# EAGLE board E-Reader (EAGLE 9.7.0)
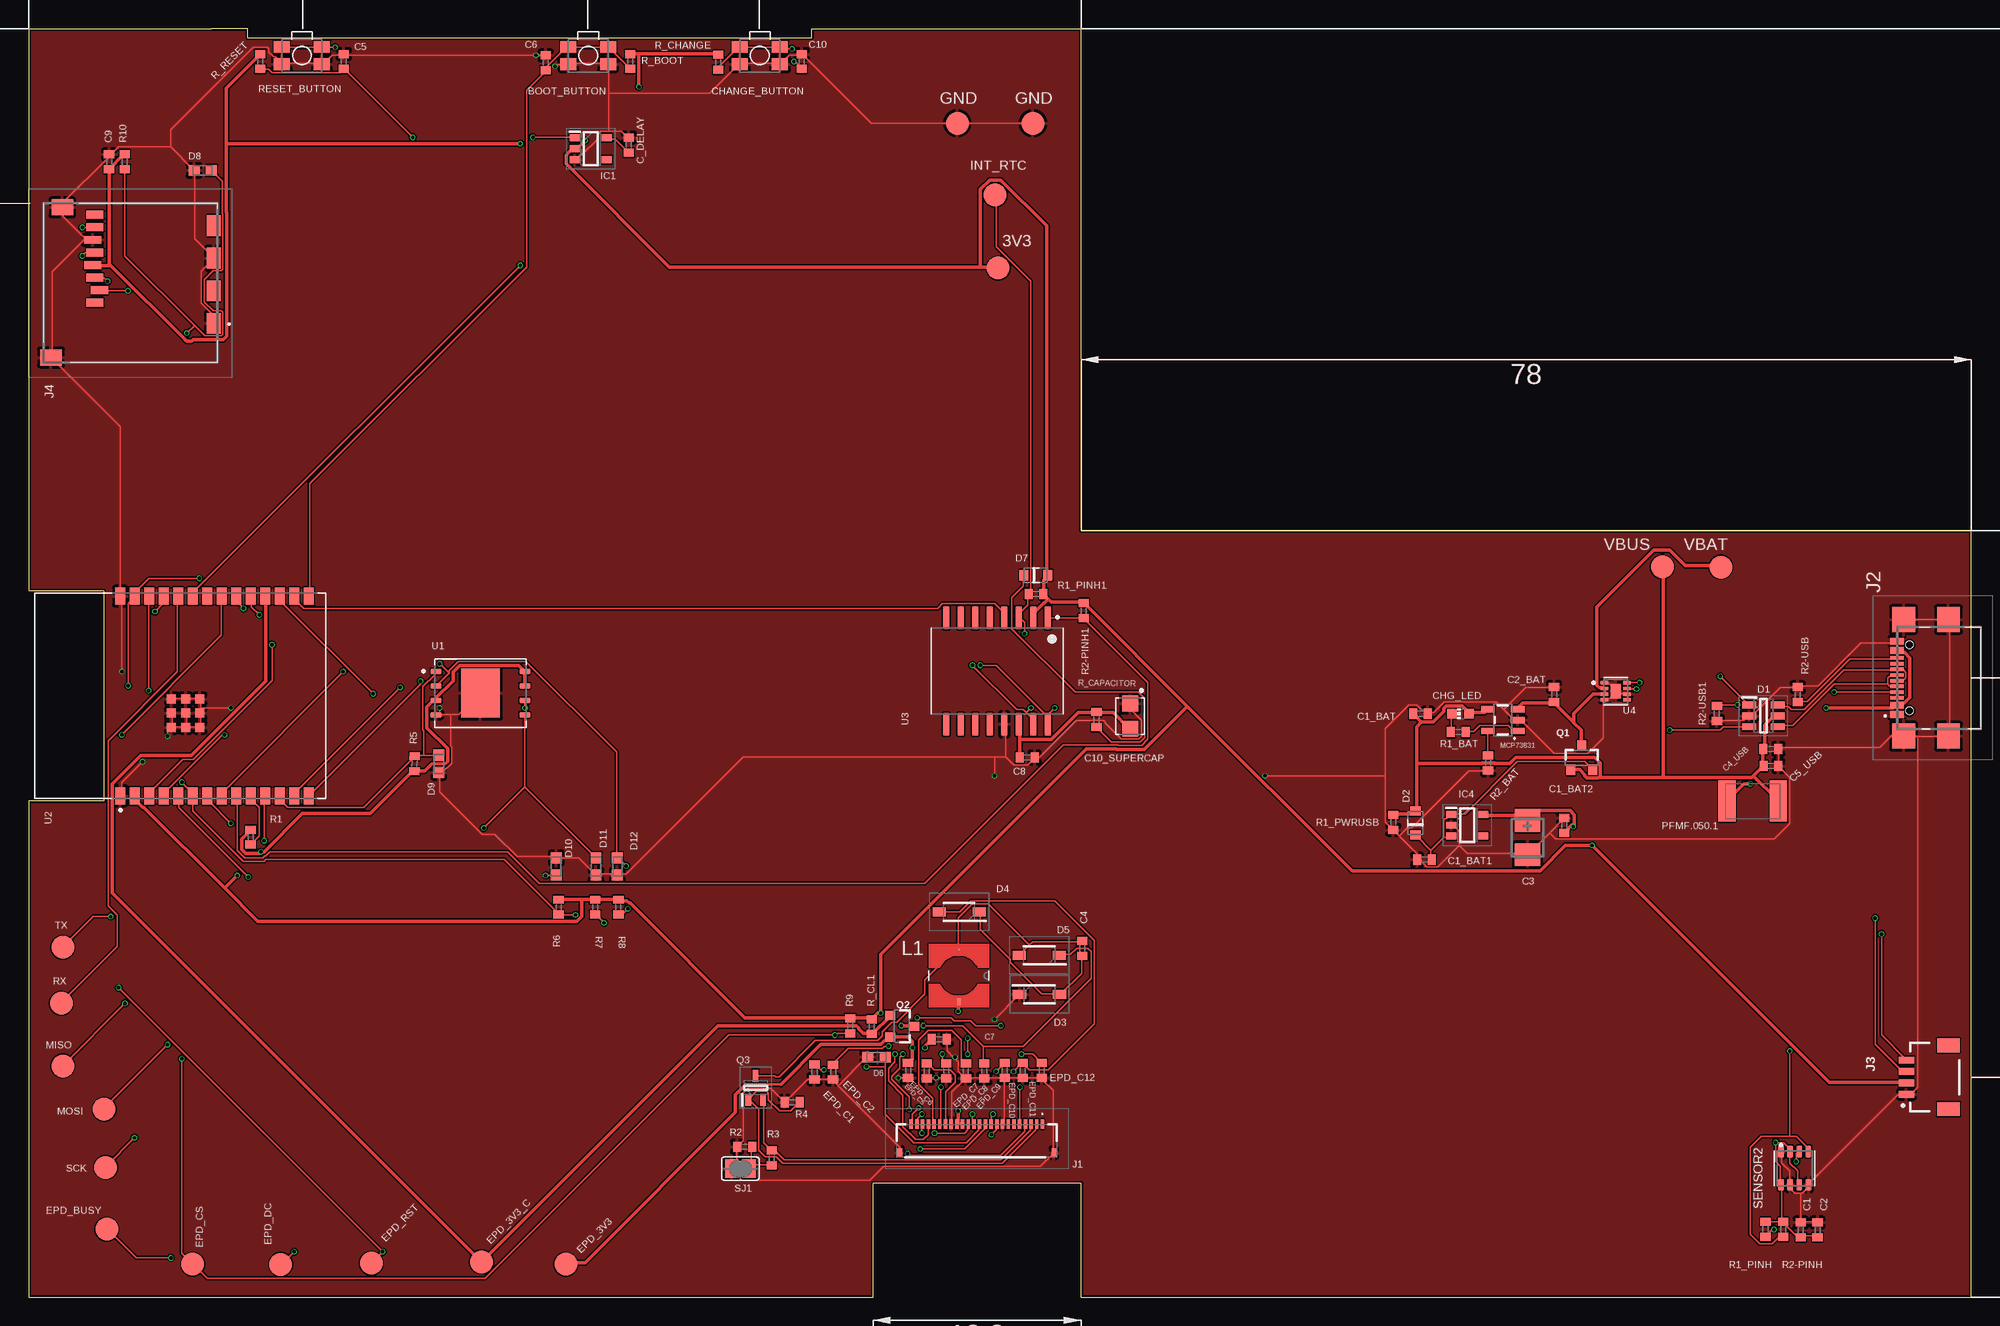
[diagram p1: board, top side]
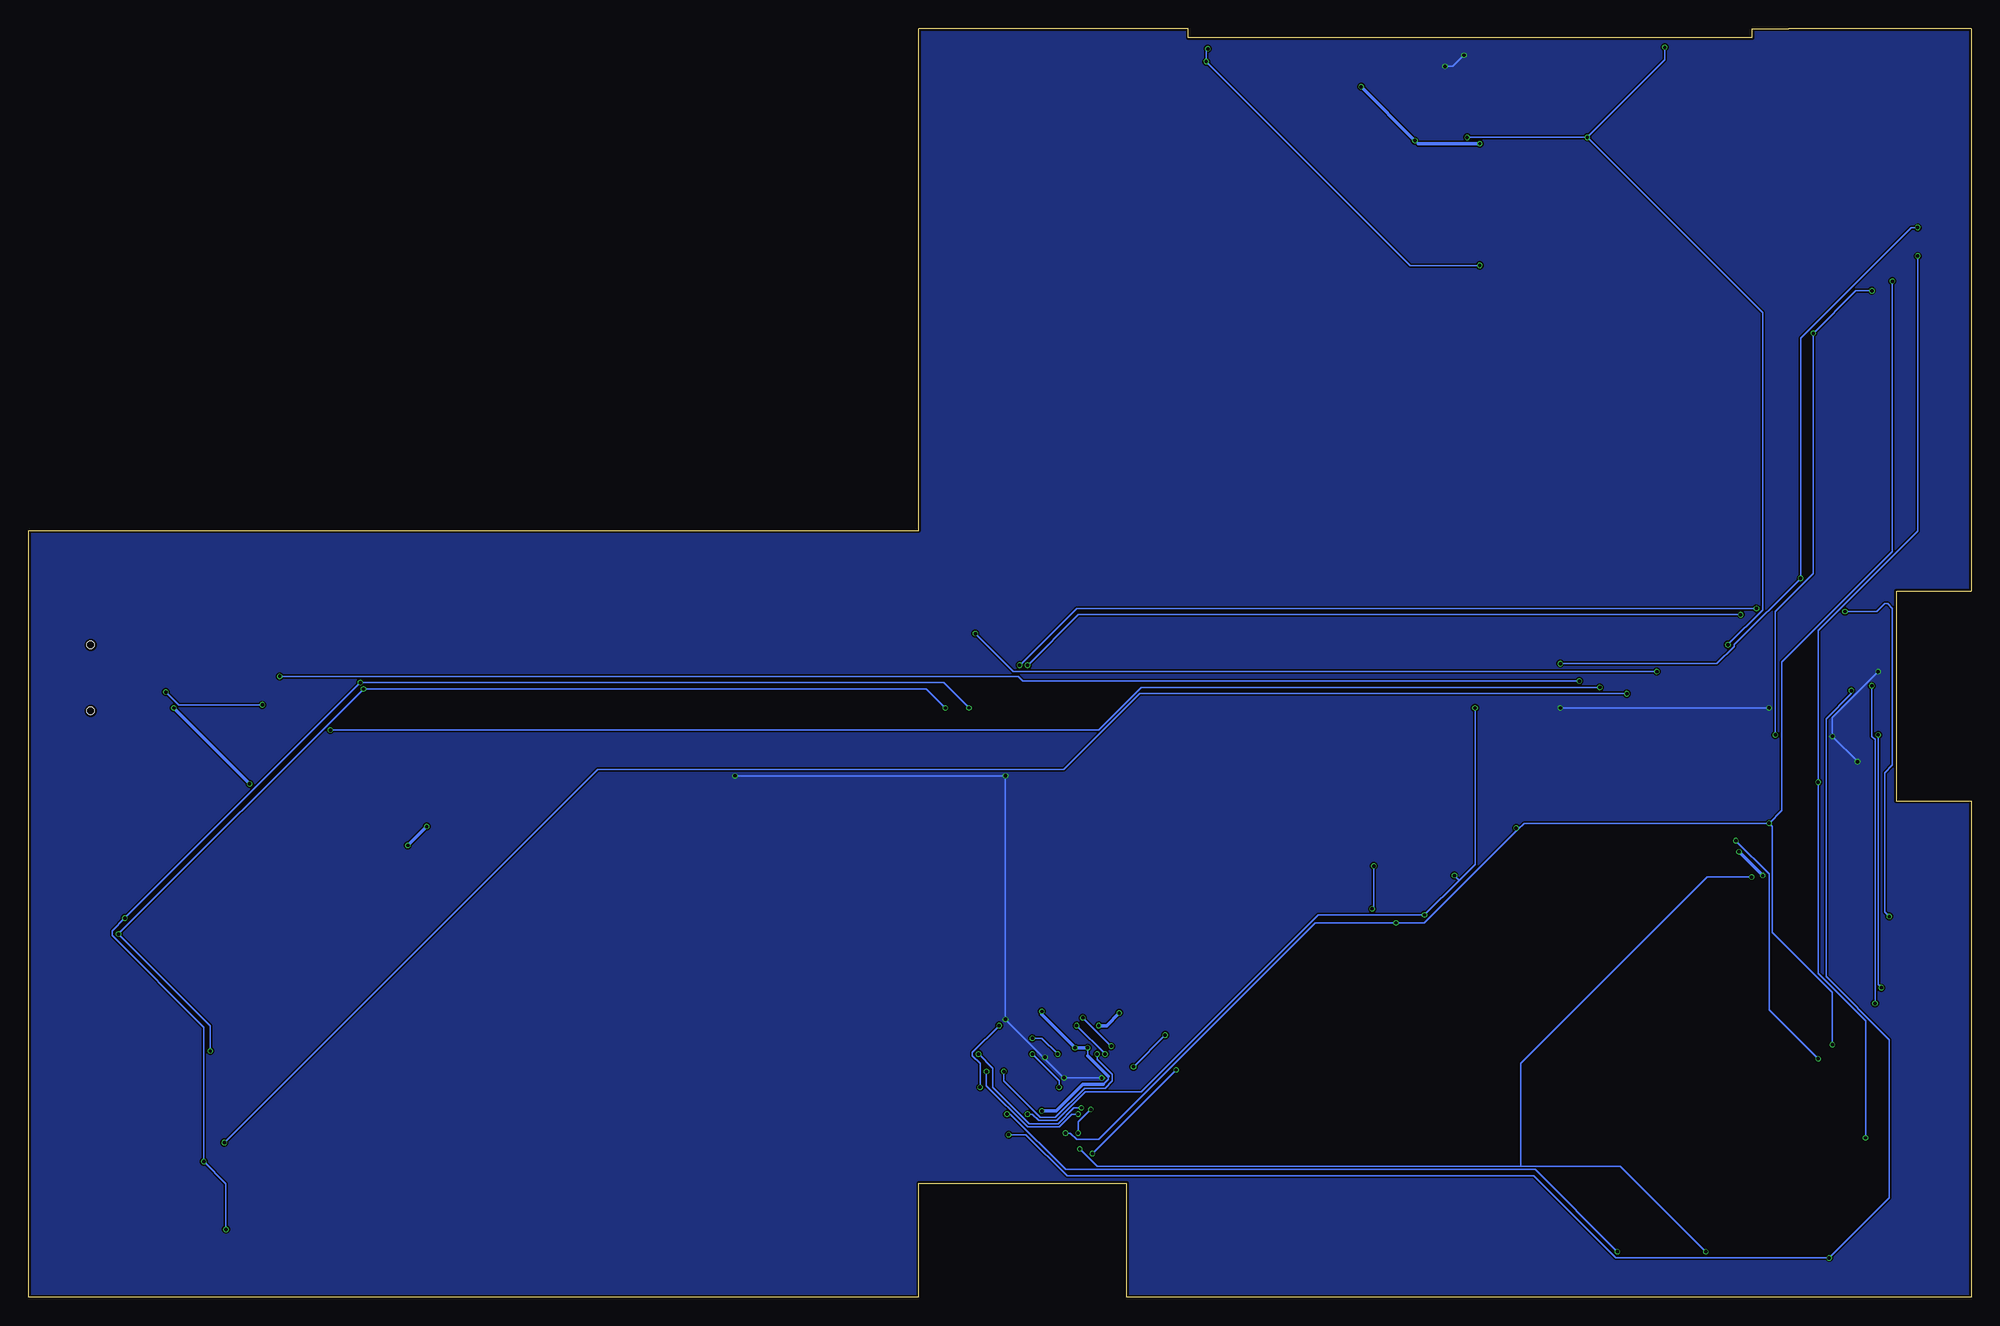
[diagram p2: board, bottom side, seen from below]

Size 170.2 x 111.2 mm. Coordinates in mm from the lower left corner, seen from the top.
Outline: 0,0 74,0 74,10 92.2,10 92.2,0 170.2,0 170.2,67.2 92.2,67.2 92.2,111.2 71.9,111.2 68.6,111.2 68.6,110.4 19.2,110.4 19.2,111.2 16,111.2 0,111.2 0,67.2 0,61.9 6.6,61.9 6.6,43.5 0,43.5 0,0
Copper layers (1*16): Top 0.035mm / dielectric 1.6mm / Bottom 0.035mm
Design rules "jlcpcb-2layers *": minimum track width 0.1mm, minimum drill 0.3mm, track to track 5mil, track to pad 5mil, pad to pad 5mil, via to via 5mil, smd to smd 5mil, copper to edge 0.2mm, drill to drill 6mil, minimum pad ring 10mil, minimum via ring 3mil, stop-mask expansion 4mil, vias tented up to drill 0mil, thermal gap 10mil

## Footprints (pad centres in the part's own frame; a part is rotated, then mirrored left to right if it is on the bottom)
MYBUTTON = smd 1.4 x 1.05: 1 1.75,0.75; 2 -1.75,0.75; 3 -1.75,-0.75; 4 1.75,-0.75
EAGLE-LTSPICE_C0402 = smd 0.7 x 0.9: 1 -0.65,0; 2 0.65,0
RCL_CT3528 = smd 2 x 2.2: + -1.5,0; - 1.5,0
CAPCP3225X100N = smd 1.4 x 1.4: 1 -1.1,0; 2 1.1,0
ADAFRUIT_CHIP-LED0603 = smd 0.8 x 0.8: A 0,-0.75; C 0,0.75
SOT95P280X145-6N = smd 1.2 x 0.6: 1 -1.25,0.95; 2 -1.25,0; 3 -1.25,-0.95; 4 1.25,-0.95; 5 1.25,0; 6 1.25,0.95
ESP32_WROVER_AVX---SD0805S020S1R0_AVX_SD0805S020S1R0_0 = smd 0.8 x 0.9: 1 -1.05,0; 2 1.05,0
SOD3716X135N = smd 1.15 x 0.8: 1 -1.75,0; 2 1.75,0
DIOC1608X36N = smd 0.97 x 0.94: 1 -0.75,0; 2 0.75,0
SOT95P280X125-5N = smd 0.9 x 0.6: 1 -1.4,0.95; 2 -1.4,0; 3 -1.4,-0.95; 4 1.4,-0.95; 5 1.4,0.95
SOT95P280X120-5N = smd 0.9 x 0.6: 1 -1.4,0.95; 2 -1.4,0; 3 -1.4,-0.95; 4 1.4,-0.95; 5 1.4,0.95
FH34SRJ24S05SH99 = smd 0.3 x 0.8: 1 5.75,1.45; 2 5.25,1.45; 3 4.75,1.45; 4 4.25,1.45; 5 3.75,1.45; 6 3.25,1.45; 7 2.75,1.45; 8 2.25,1.45; 9 1.75,1.45; 10 1.25,1.45; 11 0.75,1.45; 12 0.25,1.45; 13 -0.25,1.45; 14 -0.75,1.45; 15 -1.25,1.45; 16 -1.75,1.45; 17 -2.25,1.45; 18 -2.75,1.45; 19 -3.25,1.45; 20 -3.75,1.45; 21 -4.25,1.45; 22 -4.75,1.45; 23 -5.25,1.45; 24 -5.75,1.45 | smd 0.4 x 0.8: MP1 6.75,-1.05; MP2 -6.75,-1.05
SAMACSYS_PARTS_USB4110GFA = smd 0.3 x 1.15: A1 -3.35,3.678; A4 -2.55,3.678; A5 -1.25,3.678; A6 -0.25,3.678; A7 0.25,3.678; A8 1.25,3.678; A9 2.55,3.678; A12 3.35,3.678; B1 3.05,3.678; B4 2.25,3.678; B5 1.75,3.678; B6 0.75,3.678; B7 -0.75,3.678; B8 -1.75,3.678; B9 -2.25,3.678; B12 -3.05,3.678 | smd 2.18 x 2: MP1 -5.11,-0.827; MP2 5.11,-0.827; MP3 -5.11,3.103; MP4 5.11,3.103 | hole 0.65: -2.89,2.603; 2.89,2.603
JST04_1MM_RA = smd 0.6 x 1.35: 1 -1.5,0; 2 -0.5,0; 3 0.5,0; 4 1.5,0 | smd 1.2 x 2: NC1 2.8,-3.675; NC2 -2.8,-3.675
112ATAARR03ATTEND = smd 1.8 x 1.2: G1 10.6,10.4; G2 4.9,10.4; S1 7.75,10.4; S2 2.05,10.4 | smd 1.4 x 1.9: G3 13.6,-3.85; G4 0.45,-2.85 | smd 0.7 x 1.5: P1 8.8,0; P2 7.7,0.4; P3 6.6,0; P4 5.5,-0.2; P5 4.4,0; P6 3.3,-0.2; P7 2.2,0; P8 1.1,0
IND_4828-WE-TPC_WRE = smd 0.127 x 0.127: 1 -2.286,0 | smd 0.61 x 0.305: 2 2.286,0
ESP32_WROVER_SPARKFUN-IC-POWER_SOT23-5 = smd 0.55 x 1.2: 1 -0.95,-1.3; 2 0,-1.3; 3 0.95,-1.3; 4 0.95,1.3; 5 -0.95,1.3
ESP32C6_VARISTOR_CT/CN1812 = smd 1.5 x 3.6: 1 -2.25,0; 2 2.25,0
ESP32_WROVER_SPARKFUN-DISCRETESEMI_SOT23-3 = smd 0.8 x 0.9: 1 -0.95,-1; 2 0.95,-1; 3 0,1.1
SOT65P210X110-3N = smd 1.05 x 0.5: 1 -1.05,0.65; 2 -1.05,-0.65; 3 1.05,0
ESP32_WROVER_EAGLE-LTSPICE_R0402 = smd 0.7 x 0.9: 1 -0.65,0; 2 0.65,0
ESP32_WROVER_BME680_PSON80P300X300X100-8N = smd 1.016 x 0.5: 1 1.458,1.2; 2 1.458,0.4; 3 1.458,-0.4; 4 1.458,-1.2; 5 -1.458,-1.22; 6 -1.458,-0.4; 7 -1.458,0.4; 8 -1.458,1.2
SJ = smd 1.168 x 1.6: 1 -0.762,0; 2 0.762,0
TP20R = smd 2 x 2: TP 0,0
SON127P600X800X80-9N = smd 0.94 x 0.44: 1 -3.895,1.905; 2 -3.895,0.635; 3 -3.895,-0.635; 4 -3.895,-1.905; 5 3.895,-1.905; 6 3.895,-0.635; 7 3.895,0.635; 8 3.895,1.905 | smd 3.4 x 4.3: 9 0,0
XCVR_ESP32-C6-WROOM-1-N8 = smd 1.5 x 0.9: 1 -8.75,5.26; 2 -8.75,3.99; 3 -8.75,2.72; 4 -8.75,1.45; 5 -8.75,0.18; 6 -8.75,-1.09; 7 -8.75,-2.36; 8 -8.75,-3.63; 9 -8.75,-4.9; 10 -8.75,-6.17; 11 -8.75,-7.44; 12 -8.75,-8.71; 13 -8.75,-9.98; 14 -8.75,-11.25; 15 8.75,-11.25; 16 8.75,-9.98; 17 8.75,-8.71; 18 8.75,-7.44; 19 8.75,-6.17; 20 8.75,-4.9; 21 8.75,-3.63; 22 8.75,-2.36; 23 8.75,-1.09; 24 8.75,0.18; 25 8.75,1.45; 26 8.75,2.72; 27 8.75,3.99; 28 8.75,5.26 | smd 0.8 x 0.8: 29_1 -2.755,0.79; 29_2 -1.505,0.79; 29_3 -0.255,0.79; 29_4 -2.755,-0.46; 29_5 -1.505,-0.46; 29_6 -0.255,-0.46; 29_7 -2.755,-1.71; 29_8 -1.505,-1.71; 29_9 -0.255,-1.71
SOIC127P1032X265-16N = smd 2.05 x 0.59: 1 -4.655,4.445; 2 -4.655,3.175; 3 -4.655,1.905; 4 -4.655,0.635; 5 -4.655,-0.635; 6 -4.655,-1.905; 7 -4.655,-3.175; 8 -4.655,-4.445; 9 4.655,-4.445; 10 4.655,-3.175; 11 4.655,-1.905; 12 4.655,-0.635; 13 4.655,0.635; 14 4.655,1.905; 15 4.655,3.175; 16 4.655,4.445
SON50P200X200X80-9N = smd 0.76 x 0.27: 1 -0.985,0.75; 2 -0.985,0.25; 3 -0.985,-0.25; 4 -0.985,-0.75; 5 0.985,-0.75; 6 0.985,-0.25; 7 0.985,0.25; 8 0.985,0.75 | smd 0.9 x 1.3: 9 0,0

## Placement (x,y rotation side)
BOOT_BUTTON  BUTTON_CUSYOMV1  [MYBUTTON]  49.03,108.83 180 top
C1  100nF  [EAGLE-LTSPICE_C0402]  155.24,5.93 90 top
C1_BAT  4.7uF  [EAGLE-LTSPICE_C0402]  121.93,51.15 0 top
C1_BAT1  4.7uF  [EAGLE-LTSPICE_C0402]  122.28,38.37 180 top
C1_BAT2  4.7uF  [EAGLE-LTSPICE_C0402]  134.52,41.37 90 top
C2  100nF  [EAGLE-LTSPICE_C0402]  156.72,5.93 90 top
C2_BAT  4.7uF  [EAGLE-LTSPICE_C0402]  133.64,52.85 90 top
C3  100uF TANT  [RCL_CT3528]  131.31,40.3 270 top
C4  4.7uF/25V  [EAGLE-LTSPICE_C0402]  92.31,30.59 90 top
C4_USB  100nF  [EAGLE-LTSPICE_C0402]  152.63,48.07 0 top
C5  1uF  [EAGLE-LTSPICE_C0402]  27.61,108.31 90 top
C5_USB  4.7uF  [EAGLE-LTSPICE_C0402]  152.64,46.57 0 top
C6  100nF  [EAGLE-LTSPICE_C0402]  45.3,108.21 90 top
C7  10uF  [EAGLE-LTSPICE_C0402]  79.79,22.63 0 top
C8  100nF  [EAGLE-LTSPICE_C0402]  87.48,47.33 0 top
C9  100nF  [EAGLE-LTSPICE_C0402]  7.06,99.53 90 top
C10  100nF  [EAGLE-LTSPICE_C0402]  67.74,108.31 90 top
C10_SUPERCAP  CPH3225A  [CAPCP3225X100N]  96.49,50.94 270 top
C_DELAY  100nF  [EAGLE-LTSPICE_C0402]  52.57,100.99 90 top
CHANGE_BUTTON  BUTTON_CUSYOMV1  [MYBUTTON]  64.06,108.83 180 top
CHG_LED  [ADAFRUIT_CHIP-LED0603]  125.44,51.15 90 top
D1  USBLC6-2SC6Y  [SOT95P280X145-6N]  151.98,50.97 0 top
D2  ESP32_WROVER_AVX---SD0805S020S1R0_AVX_SD0805S020S1R0_0_0AVX_SD0805S020S1R0_0_0  [ESP32_WROVER_AVX---SD0805S020S1R0_AVX_SD0805S020S1R0_0]  121.49,41.58 90 top
D3  MBR0530  [SOD3716X135N]  88.56,26.57 0 top
D4  MBR0530  [SOD3716X135N]  81.52,33.78 180 top
D5  MBR0530  [SOD3716X135N]  88.54,29.98 180 top
D6  PGB1010603MR  [DIOC1608X36N]  74.28,21.07 0 top
D7  ESP32_WROVER_AVX---SD0805S020S1R0_AVX_SD0805S020S1R0_0_0AVX_SD0805S020S1R0_0_0  [ESP32_WROVER_AVX---SD0805S020S1R0_AVX_SD0805S020S1R0_0]  88.24,63.28 0 top
D8  PGB1010603MR  [DIOC1608X36N]  15.26,98.77 0 top
D9  PGB1010603MR  [DIOC1608X36N]  35.94,46.77 90 top
D10  PGB1010603MR  [DIOC1608X36N]  46.22,37.77 270 top
D11  PGB1010603MR  [DIOC1608X36N]  49.7,37.77 90 top
D12  PGB1010603MR  [DIOC1608X36N]  51.58,37.77 90 top
EPD_C1  1uF/50V  [EAGLE-LTSPICE_C0402]  68.85,19.77 90 top
EPD_C2  1uF/50V  [EAGLE-LTSPICE_C0402]  70.48,19.75 90 top
EPD_C5  0.1uF/50V  [EAGLE-LTSPICE_C0402]  77.05,19.89 90 top
EPD_C6  1uF/50V  [EAGLE-LTSPICE_C0402]  78.69,19.85 90 top
EPD_C7  1uF/50V  [EAGLE-LTSPICE_C0402]  80.4,19.85 90 top
EPD_C8  1uF/50V  [EAGLE-LTSPICE_C0402]  82.11,19.85 90 top
EPD_C9  1uF/50V  [EAGLE-LTSPICE_C0402]  83.72,19.85 90 top
EPD_C10  1uF/50V  [EAGLE-LTSPICE_C0402]  85.51,19.89 90 top
EPD_C11  1uF/50V  [EAGLE-LTSPICE_C0402]  87.09,19.89 90 top
EPD_C12  1uF/50V  [EAGLE-LTSPICE_C0402]  88.75,19.89 90 top
IC1  BD5229G-TR  [SOT95P280X125-5N]  49.25,100.67 0 top
IC4  XC6220A331MR-G  [SOT95P280X120-5N]  126.03,41.39 0 top
J1  FH34SRJ-24S-0.5SH_99_  [FH34SRJ24S05SH99]  83.07,13.74 0 top
J2  SAMACSYS_PARTS_USB4110-GF-A  [SAMACSYS_PARTS_USB4110GFA]  167.36,54.3 90 top
J3  QWIIC_RIGHT_ANGLE  [JST04_1MM_RA]  164.51,19.3 90 top
J4  112A-TAAR-R03_ATTEND  [112ATAARR03ATTEND]  5.82,95.98 270 top
L1  68uH  [IND_4828-WE-TPC_WRE]  81.5,28.2 270 top
MCP73831  ESP32_WROVER_SPARKFUN-IC-POWER_MCP73831  [ESP32_WROVER_SPARKFUN-IC-POWER_SOT23-5]  129.15,50.59 90 top
PFMF.050.1  ESP32C6_VARISTORCN1812  [ESP32C6_VARISTOR_CT/CN1812]  151.04,43.5 0 top
Q1  20V/4.2A/52mΩ/1.4W  [ESP32_WROVER_SPARKFUN-DISCRETESEMI_SOT23-3]  136.06,47.26 0 top
Q2  20V/4.2A/52mΩ/1.4W  [ESP32_WROVER_SPARKFUN-DISCRETESEMI_SOT23-3]  76.48,23.76 270 top
Q3  SI1308EDL-T1-GE3  [SOT65P210X110-3N]  63.69,18.38 90 top
R1  10K  [ESP32_WROVER_EAGLE-LTSPICE_R0402]  19.45,40.33 90 top
R1_BAT  200  [ESP32_WROVER_EAGLE-LTSPICE_R0402]  125.25,49.55 0 top
R1_PINH  10K  [ESP32_WROVER_EAGLE-LTSPICE_R0402]  152.16,5.97 90 top
R1_PINH1  10K  [ESP32_WROVER_EAGLE-LTSPICE_R0402]  88.26,61.64 0 top
R1_PWRUSB  100K  [ESP32_WROVER_EAGLE-LTSPICE_R0402]  119.55,41.64 90 top
R2  2.2  [ESP32_WROVER_EAGLE-LTSPICE_R0402]  62.73,13.21 0 top
R2-PINH  10K  [ESP32_WROVER_EAGLE-LTSPICE_R0402]  153.72,5.97 90 top
R2-PINH1  10K  [ESP32_WROVER_EAGLE-LTSPICE_R0402]  92.43,60.19 90 top
R2-USB  5K1  [ESP32_WROVER_EAGLE-LTSPICE_R0402]  154.98,52.83 90 top
R2-USB1  5K1  [ESP32_WROVER_EAGLE-LTSPICE_R0402]  147.9,51.17 90 top
R2_BAT  2K  [ESP32_WROVER_EAGLE-LTSPICE_R0402]  127.86,46.85 90 top
R3  0.47  [ESP32_WROVER_EAGLE-LTSPICE_R0402]  65.11,12.23 90 top
R4  10K  [ESP32_WROVER_EAGLE-LTSPICE_R0402]  66.89,17.11 0 top
R5  10K  [ESP32_WROVER_EAGLE-LTSPICE_R0402]  33.81,46.78 268.5 top
R6  10K  [ESP32_WROVER_EAGLE-LTSPICE_R0402]  46.43,34.21 90 top
R7  10K  [ESP32_WROVER_EAGLE-LTSPICE_R0402]  49.65,34.21 90 top
R8  10K  [ESP32_WROVER_EAGLE-LTSPICE_R0402]  51.67,34.21 90 top
R9  10K  [ESP32_WROVER_EAGLE-LTSPICE_R0402]  71.99,23.81 90 top
R10  10K  [ESP32_WROVER_EAGLE-LTSPICE_R0402]  8.43,99.53 90 top
R_BOOT  10K  [ESP32_WROVER_EAGLE-LTSPICE_R0402]  52.71,108.31 90 top
R_CAPACITOR  15  [ESP32_WROVER_EAGLE-LTSPICE_R0402]  93.55,50.64 90 top
R_CHANGE  10K  [ESP32_WROVER_EAGLE-LTSPICE_R0402]  60.42,108.24 90 top
R_CL1  10K  [ESP32_WROVER_EAGLE-LTSPICE_R0402]  73.86,23.73 90 top
R_RESET  10K  [ESP32_WROVER_EAGLE-LTSPICE_R0402]  20.29,108.31 90 top
RESET_BUTTON  BUTTON_CUSYOMV1  [MYBUTTON]  23.95,108.83 180 top
SENSOR2  BME688  [ESP32_WROVER_BME680_PSON80P300X300X100-8N]  154.71,11.32 90 top
SJ1  [SJ]  62.36,11.29 0 top
TP1  TPTP20R  [TP20R]  3.01,30.69 0 top
TP2  TPTP20R  [TP20R]  2.88,25.79 0 top
TP3  TPTP20R  [TP20R]  148.25,63.99 0 top
TP4  TPTP20R  [TP20R]  81.37,102.89 0 top
TP5  TPTP20R  [TP20R]  87.99,102.89 0 top
TP6  TPTP20R  [TP20R]  3.01,20.29 0 top
TP7  TPTP20R  [TP20R]  6.63,16.49 0 top
TP8  TPTP20R  [TP20R]  6.75,11.39 0 top
TP9  TPTP20R  [TP20R]  6.87,5.99 0 top
TP10  TPTP20R  [TP20R]  14.38,2.91 0 top
TP11  TPTP20R  [TP20R]  22.09,2.89 0 top
TP12  TPTP20R  [TP20R]  30.03,3.01 0 top
TP13  TPTP20R  [TP20R]  39.68,3.11 0 top
TP14  TPTP20R  [TP20R]  143.13,64.01 0 top
TP15  TPTP20R  [TP20R]  84.68,96.61 0 top
TP16  TPTP20R  [TP20R]  84.93,90.21 0 top
TP17  TPTP20R  [TP20R]  47.08,2.91 0 top
U1  W25Q512JVEIQ  [SON127P600X800X80-9N]  39.59,52.96 0 top
U2  ESP32-C6-WROOM-1-N8  [XCVR_ESP32-C6-WROOM-1-N8]  13.3,52.71 90 top
U3  DS3231SN#  [SOIC127P1032X265-16N]  84.85,54.9 270 top
U4  MAX17048G+T10  [SON50P200X200X80-9N]  139.04,53.12 0 top

## Tracks (layer width: path | path; a pad name or v marks a point on that pad's centre or on a via)
3V3  (via drill 0.3)
  Top 0.15: 72.02,24.52 R9.2 | 77.56,23.82 Q2.3 | 73.96,24.52 R_CL1.2 | 49.58,34.9 R7.2 | 51.66,34.9 R8.2 | 131.3,41.83 C3.+ 131.44,41.83 | C9.1 7.06,98.75 | 7.06,90.44 7.2,90.44 | 5.68,90.44 J4.P4 | 89.19,63.16 D7.2 89.19,63.29 | 92.38,60.94 R2-PINH1.2 | 52.77,109 R_BOOT.2 | 84.9,90.3 TP16.TP | IC1.2 47.92,100.55
  Top 0.254: 35.29,46.71 35.35,46.78 36.53,46.78 36.7,46.95
  Top 0.3: U1.7 43.49,54.85 U1.8 43.35,54.98 42.94,55.4 37.81,55.4 37.79,55.4 37.19,54.8 37.19,54.04 35.62,52.48 | R1.2 19.39,40.86 18.7,40.16 18.7,39.24 19.04,38.9 19.2,38.9 20.2,38.9 v20.36,39.06 20.64,39.06 23.98,42.4 24.7,42.4 29.93,42.4 30.19,42.66 33.02,45.48 33.66,46.12 R5.2 34.7,46.13 35.29,46.71 | 72.02,24.52 73.82,24.52 R_CL1.2 | v76.45,23.82 77.56,23.82 | 73.96,24.52 74.37,24.93 v74.65,24.93 74.65,30.05 92.66,48.06 95.3,48.06 95.33,48.03 97.75,48.03 101.52,51.8 | 49.58,34.9 48.48,34.9 | 48.48,34.9 46.54,34.9 R6.2 | 51.66,34.9 49.72,34.9 R7.2 | 17.17,35.87 20.08,32.96 20.11,32.93 48.03,32.93 48.48,33.38 48.48,34.9 | U2.2 9.42,43.9 9.42,43.63 9.42,43.53 10.02,42.93 10.11,42.93 17.17,35.87 | R9.2 71.88,24.52 62.74,24.52 53,34.25 53,34.26 52.71,34.56 52.61,34.56 52.4,34.76 51.8,34.76 R8.2 | 17.17,35.87 v18.28,36.98 | 131.3,41.83 130.88,42.24 127.56,42.24 IC4.5 | 131.44,41.83 132.27,42.66 135.04,42.66 135.07,42.66 135.25,42.48 135.25,42.45 135.4,42.3 135.4,41.36 v135.31,41.27 135.18,41.41 134.62,40.86 C1_BAT2.1 | J3.2 164.4,18.84 157.75,18.84 v136.98,39.61 134.62,39.61 132.41,37.4 132.38,37.37 115.95,37.37 101.52,51.8 | C9.1 8.31,100.14 R10.2 | 17.31,101.11 17.31,105.95 20.22,108.86 R_RESET.2 | 7.2,90.44 13.71,83.93 13.74,83.9 13.84,83.8 14.3,83.8 14.42,83.92 17.05,83.92 17.37,84.25 17.37,95.06 17.31,95.11 17.31,101.11 | 5.68,90.44 7.06,90.44 7.06,98.75 | 89.19,63.16 88.92,62.88 88.92,61.77 R1_PINH1.2 89.33,61.22 | 92.38,60.94 89.61,60.94 89.33,61.22 | U3.2 88.09,59.55 88.09,59.97 88.09,60.02 88.93,60.86 88.97,60.86 89.33,61.22 | 53.46,109 60.39,109 R_CHANGE.2
  Top 0.3: 53.46,109 52.77,109 | 84.9,90.3 83.38,90.3 | 83.38,90.3 56.23,90.3 56.13,90.3 47.09,99.34 47.09,100 47.09,100.1 47.34,100.36 | v53.46,106.09 53.46,109 | 89.19,63.29 89.19,93.9 85.18,97.92 84.21,97.92 84.18,97.92 83.38,97.11 83.38,90.3 | v43.07,101.11 17.31,101.11 | 101.52,51.8 92.52,60.8 R2-PINH1.2 | v48.75,101.38 48.58,101.21 48.58,101.2 48.24,100.86 | 47.92,100.55 48.09,100.71 | 48.09,100.71 48.24,100.86 | 47.34,100.36 47.7,100.71 48.09,100.71 | 47.34,100.36 47.85,100.86 48.24,100.86 | 35.62,52.48 34.9,51.75 34.9,51.6 34.9,51 34.9,49.91 36.7,48.1 36.7,46.95 | U1.3 35.62,52.4 35.62,52.48
  Bottom 0.15: v48.75,101.38 48.48,101.11
  Bottom 0.3: v76.45,23.82 75.76,23.82 v74.65,24.93 | v18.28,36.98 v20.36,39.06 | v135.31,41.27 v136.98,39.61 | v48.75,101.38 v53.46,106.09 | 48.48,101.11 v43.07,101.11
32KHZ
  Top 0.15: U3.1 89.33,59.55 92.38,59.55 R2-PINH1.1 92.52,59.42 98.06,53.88 98.06,48.94 97.5,48.38 95.48,48.38 95.45,48.41 90.65,48.41 78.53,36.29 44.74,36.29 41.97,39.06 21.13,39.06 20.78,38.7 20.7,38.7 20.5,38.5 18.94,38.5 18.28,39.16 18.28,43.9 U2.9
DN
  Top 0.15: 162.88,53.74 163.01,53.6 163.57,53.6 J2.B7 | 162.88,53.74 162.88,54.29 163.01,54.43 163.57,54.43 J2.A7 | 162.88,53.74 158.17,53.74 154.57,50.14 153.32,50.14 D1.4
DP
  Top 0.15: J2.A6 163.71,54.15 164.29,54.15 164.46,54.32 164.46,54.78 164.25,54.98 163.71,54.98 J2.B6 163.57,54.98 159,54.98 155.54,51.52 154.43,51.52 154.15,51.8 153.32,51.8 D1.6
EPD_3V3  (via drill 0.3)
  Top 0.15: 81.44,15.23 J1.16 | 75.48,22.85 Q2.2 | v78.53,21.88 78.53,22.02 | 79.08,22.58 C7.1 | 47.09,3.05 TP17.TP
  Top 0.2: 62.85,18.7 63.33,18.7 63.35,18.68 65.91,18.68 65.93,18.7
  Top 0.3: 81.44,15.23 81.72,15.23 J1.15 | 75.48,22.85 77.01,22.85 77.42,22.44 v77.42,21.88 77.42,20.91 77.14,20.64 EPD_C5.2 | 78.53,22.02 79.08,22.58 | v81.44,16.34 81.44,15.23 | 81.44,15.23 J1.16 | 47.09,3.05 48.75,3.05 61.91,16.2 61.91,17.73 61.91,17.76 62.85,18.7 | 65.93,18.7 69.39,22.16 74.65,22.16 75.34,22.85 Q2.2 | v81.44,25.07 81.44,25.4 L1.2
  Bottom 0.15: 76.04,18.7 75.62,19.11 75.62,19.39 | v77.42,21.88 77.42,21.19 | 81.44,24.79 v81.44,25.07
  Bottom 0.3: v77.42,21.88 v78.53,21.88 81.44,24.79 | v81.44,16.34 80.19,16.34 77.84,18.7 76.04,18.7 | 77.42,21.19 75.62,19.39
EPD_3V3_C
  Top 0.15: 73.96,23.13 R_CL1.1 73.82,23.13 | 75.48,24.65 Q2.1 | 20.77,61.35 U2.18 | 39.61,3.19 TP13.TP 39.75,3.19
  Top 0.3: 75.48,24.65 73.96,23.13 | 20.77,61.35 20.77,54.02 14.27,47.51 9.83,47.51 7.31,44.98 7.31,35.48 7.34,35.46 39.61,3.19 | 73.82,23.13 73.13,23.13 72.72,23.54 72.72,23.62 72.52,23.82 60.39,23.82 39.75,3.19
EPD_BUSY  (via drill 0.3)
  Top 0.15: v84.35,14.27 84.76,14.68 84.76,15.1 J1.9 | v12.46,3.46 9.42,3.46 6.92,5.96 TP9.TP | v10.53,53.18 10.53,61.35 U2.26
  Bottom 0.15: v84.35,14.27 82.82,14.27 79.22,10.66 38.36,10.66 31.16,3.46 v12.46,3.46 7.2,8.73 7.2,22.58 12.74,28.12 12.74,50.69 10.53,52.91 v10.53,53.18
EPD_CS  (via drill 0.3)
  Top 0.15: 75.07,20.22 75.07,21.05 D6.2 | 75.07,20.22 75.07,16.07 77.56,13.57 82.13,13.57 83.24,14.68 83.24,15.1 J1.12 | 75.07,20.22 v73.41,20.22 | R9.1 71.88,23.13 70.77,23.13 v70.64,22.99 61.35,22.99 40.03,1.66 15.65,1.66 14.4,2.91 TP10.TP 14.27,3.05 13.43,3.88 v13.43,20.91 | v20.64,40.03 20.64,43.9 U2.11
  Bottom 0.15: v73.41,20.22 v70.64,22.99 | v20.64,40.03 17.73,37.12 17.73,25.21 v13.43,20.91
EPD_DC  (via drill 0.3)
  Top 0.15: v78.11,13.02 81.99,13.02 83.79,14.82 83.79,15.1 J1.11 | v23.27,4.02 22.16,2.91 TP11.TP | v19.25,36.84 13.16,42.94 13.16,43.9 U2.5
  Bottom 0.15: v78.11,13.02 76.59,11.49 39.47,11.49 | 39.47,11.49 30.75,11.49 v23.27,4.02 | v19.25,36.84 23.13,36.84 39.47,20.5 39.47,11.49
EPD_RST  (via drill 0.3)
  Top 0.15: v84.48,16.07 84.35,15.93 84.35,15.23 J1.10 | TP12.TP 30.05,3.05 v31.02,4.02 v7.89,27.15 | v8.17,49.31 16.9,58.03 16.9,61.35 U2.21
  Bottom 0.15: v84.48,16.07 84.21,16.07 79.36,11.22 38.23,11.22 v31.02,4.02 | v8.17,49.31 8.17,27.42 v7.89,27.15
FLASH_CS
  Top 0.15: 34.62,47.51 35.87,47.51 D9.2 | 34.62,47.51 33.93,47.51 R5.1 33.79,47.37 29.36,42.94 22.71,42.94 22.02,43.63 22.02,43.9 U2.12 | U1.1 35.59,54.85 35.59,54.57 34.55,53.52 34.55,49.71 34.62,49.64 34.62,47.51
GDR
  Top 0.15: J1.2 88.22,15.1 88.22,14.68 85.32,11.77 66.06,11.77 65.51,12.33 64.54,12.33 63.99,12.88 63.99,16.48 63.16,17.31 Q3.1 63.77,18.06 64.67,18.06 64.82,17.91 64.82,17.31 65.79,16.34 66.76,16.34 67.45,17.04 R4.2
GND  (via drill 0.3)
  Top 0.15: U2.29_3 12.6,52.49 13.71,52.49 U2.29_6 13.85,52.49 14.96,52.49 U2.29_9 15.1,52.35 15.1,51.66 | 12.6,50 12.6,51.11 U2.29_2 | 12.6,50 U2.29_1 | 13.85,50 13.85,51.11 U2.29_5 | 13.85,50 U2.29_4 | 12.6,50 13.71,50 U2.29_4 | 12.6,50 U2.29_1 | 13.85,50 14.96,50 U2.29_7 15.1,50 15.1,51.11 U2.29_8 15.1,51.24 15.1,51.66 | 13.85,50 U2.29_4 | v12.19,49.17 12.19,49.58 12.46,49.86 U2.29_1 | U2.1 8.17,44.04 8.17,45.13 v9.98,46.94 | v8.17,54.85 8.17,61.35 U2.28 8.03,61.49 8.03,76.31 2.08,82.27 J4.G3 2.08,82.41 2.08,89.89 4.99,92.8 | TP5.TP 87.95,102.91 81.44,102.91 TP4.TP 81.3,102.91 73.82,102.91 67.86,108.86 C10.2 67.73,108.86 66.62,108.86 65.93,108.17 CHANGE_BUTTON.2 65.79,108.17 62.33,108.17 CHANGE_BUTTON.1 62.19,108.03 59.69,105.54 50.83,105.54 | 50.83,102.21 51.94,102.21 52.49,101.66 C_DELAY.2 | 50.83,102.21 50.14,102.21 49.86,101.94 49.86,101.52 48.48,100.14 48.34,100.14 47.92,99.72 IC1.3 | 50.83,102.21 50.83,105.54 | 50.83,105.54 50.83,108.03 BOOT_BUTTON.2 50.69,108.17 47.37,108.17 BOOT_BUTTON.1 47.23,108.03 46.26,108.03 v46.12,107.89 | C6.2 v44.46,108.86 27.7,108.86 C5.2 27.56,108.86 26.59,108.86 25.76,108.03 RESET_BUTTON.2 25.62,108.17 22.3,108.17 RESET_BUTTON.1 22.16,108.17 21.61,108.72 21.47,108.72 21.05,109.14 21.05,109.42 20.91,109.55 19.67,109.55 12.46,102.35 12.46,100.83 | 4.99,92.8 5.54,92.8 J4.P6 4.99,92.8 | 4.99,92.8 3.05,94.73 3.05,95.43 J4.G4 3.05,95.56 3.05,95.98 6.92,99.86 6.92,100.14 C9.2 7.06,100.27 7.34,100.27 7.89,100.83 12.46,100.83 | J4.G1 16.2,85.45 16.2,86.06 15.14,87.13 15.14,89.93 16.2,91 J4.G2 16.2,91.13 14.54,92.8 14.54,98.75 D8.1 14.4,98.89 12.46,100.83
  Top 0.15: 138.92,52.91 139.05,53.05 U4.9 | 138.92,52.91 138.5,52.49 138.08,52.49 U4.4 137.95,52.35 137.95,49.03 136.57,47.66 133.64,47.66 130.74,50.55 130.47,50.55 MCP73831.2 130.33,50.69 130.05,50.69 129.22,51.52 | U4.9 139.05,53.18 138.5,53.74 138.19,53.74 U4.1 | 138.92,52.91 140.02,52.91 U4.6 | 138.92,52.91 U4.9 | 129.22,51.52 131.16,53.46 133.51,53.46 C2_BAT.2 | 133.24,40.72 131.44,38.92 C3.- 131.3,38.92 126.03,38.92 125.34,39.61 | 133.24,40.72 134.48,41.97 C1_BAT2.2 | 120.08,40.44 119.66,40.86 R1_PWRUSB.1 119.53,41 118.83,41.69 118.83,45.7 | 120.08,40.44 121.6,38.92 121.6,38.5 C1_BAT1.2 121.84,38.37 122.5,37.72 123.45,37.72 125.34,39.61 | 125.34,39.61 125.34,40.86 124.93,41.27 124.65,41.27 IC4.2 | 120.08,40.44 120.77,41.13 121.19,41.13 126.17,46.12 127.83,46.12 R2_BAT.1 | 118.83,45.7 118.83,49.86 120.91,51.94 121.6,51.94 122.3,51.24 122.57,51.24 C1_BAT.2 122.71,51.24 123.09,51.24 124.03,52.18 128.56,52.18 129.22,51.52 | 155.26,6.65 156.64,6.65 C2.2 | 155.26,6.65 C1.2 155.26,6.65 | 155.26,9.14 155.4,9.14 155.81,9.56 155.81,9.83 SENSOR2.5 155.95,9.97 163.71,17.73 164.4,17.73 J3.1 164.54,17.87 164.95,17.87 165.51,18.42 165.51,49.17 | 155.26,9.14 154.7,9.14 154.43,9.42 154.43,9.83 SENSOR2.7 154.29,9.97 154.29,11.08 153.6,11.77 153.6,12.74 SENSOR2.1 | 155.26,9.14 155.26,6.65 | R2-USB1.1 147.92,50.55 150.27,50.55 150.69,50.97 D1.2 150.83,51.11 151.1,51.11 153.46,53.46 154.84,53.46 R2-USB.2 154.98,53.6 156.78,53.6 160.52,57.34 163.57,57.34 J2.B1 163.71,57.48 163.71,57.62 J2.A12 163.71,57.76 163.71,58.86 164.12,59.28 J2.MP4 168.14,59.42 J2.MP2 168.28,59.28 168.28,49.31 J2.MP1 168.14,49.17 165.51,49.17
  Top 0.15: J2.B12 163.71,51.24 163.71,50.97 J2.A1 163.71,50.83 163.71,49.72 | 163.71,49.72 164.12,49.31 J2.MP3 | 163.71,49.72 162.18,48.2 153.32,48.2 C4_USB.2 153.32,48.06 153.32,46.67 C5_USB.2 153.32,46.54 154.29,45.57 154.29,41.55 152.9,40.16 133.79,40.16 133.24,40.72 | 163.71,49.72 J2.MP3 | 165.51,49.17 164.26,49.17 J2.MP3 | 70.91,18.56 70.5,18.97 EPD_C2.1 70.36,19.11 68.97,19.11 EPD_C1.1 68.83,19.11 68.28,19.11 66.34,17.17 R4.1 65.02,18.33 62.98,18.33 62.59,17.94 62.59,13.72 R2.1 62.05,13.16 62.05,11.77 61.63,11.36 SJ1.1 61.63,11.22 62.33,10.53 62.33,10.39 62.46,10.25 73.68,10.25 74.93,11.49 88.64,11.49 89.75,12.6 J1.MP1 89.75,12.74 89.75,18.14 88.78,19.11 EPD_C12.1 88.64,19.25 87.12,19.25 EPD_C11.1 86.98,19.25 85.59,19.25 EPD_C10.1 | 70.91,18.56 76.31,13.16 76.31,12.74 J1.MP2 | 70.91,18.56 73.41,21.05 D6.1 | EPD_C6.1 78.81,19.25 v79.5,19.25 80.33,19.25 EPD_C7.1 | v84.62,24.38 86.7,26.45 D3.1 | J1.17 80.88,15.23 80.88,18 81.99,19.11 EPD_C8.1 | EPD_C8.1 82.13,19.25 83.65,19.25 EPD_C9.1 83.79,19.25 85.45,19.25 EPD_C10.1 | 81.02,21.05 81.44,20.64 81.44,19.8 81.99,19.25 EPD_C8.1 | 81.02,21.05 80.47,21.61 80.47,22.58 C7.2 | J1.8 85.45,15.23 85.45,19.11 EPD_C10.1 | 81.02,21.05 v81.16,21.05 | 85.59,47.37 86.28,46.67 87.53,46.67 88.09,47.23 C8.2 88.22,47.37 88.58,47.37 91.77,50.55 94.18,50.55 94.32,50.41 94.32,50.33 95.71,48.94 97.27,48.94 97.5,49.17 97.5,50.55 96.53,51.52 96.53,51.94 C10_SUPERCAP.1 | 85.59,47.37 85.59,50.14 U3.13 | 36.98,51.11 37.67,51.11 39.47,52.91 U1.9 | 36.98,51.11 36.01,51.11 | 36.01,51.11 35.73,51.11 U1.4 36.01,51.11 | 84.62,47.37 62.6,47.37 52.35,37.12 51.66,37.12 D12.1 51.52,37.12 49.72,37.12 D11.1 49.58,37.12 48.2,38.5 46.26,38.5 D10.1 46.12,38.64 42.8,38.64 40.86,40.58 39.75,40.58 36.01,44.32 36.01,45.98 D9.1 36.01,46.12 36.37,46.12 37.05,46.81 37.05,48.25 36.98,48.33 36.98,51.11
  Top 0.15: 84.62,47.37 85.59,47.37 | 84.62,47.37 v84.62,45.7 | 36.01,51.11 v36.01,51.66 | v108.32,45.72 v108.33,45.7 118.83,45.7 | v17.72,51.67 17.71,51.66 15.1,51.66 | v76.19,19.24 EPD_C5.1
  Bottom 0.15: v8.17,54.85 12.19,50.83 v12.19,49.17 9.98,46.96 v9.98,46.94 | v46.12,107.89 45.43,107.89 v44.46,108.86 | 81.3,21.05 v79.5,19.25 76.19,19.25 v76.19,19.24 | 81.3,21.05 v84.62,24.38 v84.62,45.7 108.31,45.7 v108.32,45.72 | v81.16,21.05 81.3,21.05 | v36.01,51.66 v17.73,51.66 v17.72,51.67
  pour Bottom: 73.96,10.06 73.98,10.08 92.22,10.08 92.24,10.06 92.26,10.04 92.28,10.02 92.28,0.08 170.12,0.08 170.12,67.12 92.18,67.12 92.16,67.14 92.14,67.16 92.12,67.18 92.12,111.12 68.68,111.12 68.68,110.38 68.66,110.36 68.64,110.34 68.62,110.32 19.18,110.32 19.16,110.34 19.14,110.36 19.12,110.38 19.12,111.12 0.08,111.12 0.08,61.98 6.62,61.98 6.64,61.96 6.66,61.94 6.68,61.92 6.68,43.48 6.66,43.46 6.64,43.44 6.62,43.42 0.08,43.42 0.08,0.08 73.92,0.08 73.92,10.02 73.94,10.04
  pour Top: 73.96,10.06 73.98,10.08 92.22,10.08 92.24,10.06 92.26,10.04 92.28,10.02 92.28,0.08 170.12,0.08 170.12,67.12 92.18,67.12 92.16,67.14 92.14,67.16 92.12,67.18 92.12,111.12 68.68,111.12 68.68,110.38 68.66,110.36 68.64,110.34 68.62,110.32 19.18,110.32 19.16,110.34 19.14,110.36 19.12,110.38 19.12,111.12 0.08,111.12 0.08,61.98 6.62,61.98 6.64,61.96 6.66,61.94 6.68,61.92 6.68,43.48 6.66,43.46 6.64,43.44 6.62,43.42 0.08,43.42 0.08,0.08 73.92,0.08 73.92,10.02 73.94,10.04
GPIO8
  Top 0.15: R1.1 19.53,39.75 20.22,40.44 20.22,42.94 19.53,43.63 19.53,43.9 U2.10
I2C_PW  (via drill 0.3)
  Top 0.15: C2.1 156.64,5.4 155.26,5.4 C1.1 155.12,5.4 154.84,5.4 153.74,6.51 R2-PINH.2 | 153.6,6.65 152.21,6.65 R1_PINH.2 | 153.6,6.65 R2-PINH.2 | 153.6,6.65 153.6,9.83 SENSOR2.8 153.46,9.97 153.46,11.49 153.04,11.91 v153.04,13.57 153.74,13.57 154.43,12.88 SENSOR2.2 154.29,12.74 154.29,11.77 154.98,11.08 154.98,9.97 SENSOR2.6 | 153.6,6.65 R2-PINH.2 | v30.19,52.91 22.02,61.08 22.02,61.35 U2.17
  Bottom 0.15: v30.19,52.91 72.85,52.91 79.5,46.26 120.36,46.26 v153.04,13.57
INT_RTC  (via drill 0.3)
  Top 0.15: 86.84,59.55 86.84,59.97 87.53,60.66 87.53,61.63 R1_PINH1.1 87.67,61.77 87.81,61.91 87.81,89.06 84.76,92.1 84.76,96.53 TP15.TP | 86.84,59.55 U3.3 86.84,59.55 | v27.56,54.85 17.04,44.32 17.04,44.04 U2.8 | v87.25,58.17 87.25,59.14 86.84,59.55
  Bottom 0.15: v27.56,54.85 83.93,54.85 v87.25,58.17
IO/BOOT
  Top 0.15: R_BOOT.1 52.63,107.75 50.83,109.55 BOOT_BUTTON.3 50.69,109.55 47.37,109.55 BOOT_BUTTON.4 47.23,109.69 45.43,107.89 45.43,107.61 C6.1 45.29,107.48 43.63,105.81 43.63,90.3 24.65,71.33 24.65,61.49 U2.15
IO/CHANGE  (via drill 0.3)
  Top 0.15: R_CHANGE.1 60.52,107.61 60.52,107.89 62.19,109.55 CHANGE_BUTTON.4 62.33,109.55 65.79,109.55 CHANGE_BUTTON.3 65.93,109.55 66.06,109.42 v66.89,109.42 | v67.03,108.31 67.17,108.31 67.73,107.75 C10.1 | v43.07,90.44 14.4,61.77 14.4,61.49 U2.23
  Bottom 0.15: v66.89,109.42 67.03,109.28 v67.03,108.31 49.17,90.44 v43.07,90.44
MISO  (via drill 0.3)
  Top 0.15: v52.35,37.81 51.66,38.5 D12.2 51.52,38.64 51.52,47.78 43.55,55.75 37.64,55.75 36.84,54.95 36.84,54.71 | 36.84,54.71 35.73,53.6 U1.2 | v14.96,63.02 10.53,63.02 9.42,61.91 9.42,61.49 U2.27 9.28,61.35 8.73,60.8 v8.73,53.6 | 36.84,54.71 v36.01,55.54 | v4.71,93.76 5.68,93.76 J4.P7 | v8.45,25.76 3.05,20.36 TP6.TP | 51.7,33.56 R8.1 | v52.5,34.05 52,33.56
  Top 0.3: 52,33.56 51.7,33.56
  Bottom 0.15: v52.35,37.81 52.35,34.2 v52.5,34.05 | v36.01,55.54 22.3,55.54 20.77,57.06 20.77,57.2 v14.96,63.02 14.96,84.07 5.26,93.76 v4.71,93.76 | v8.45,25.76 8.45,48.89 8.73,49.17 v8.73,53.6
MOSI  (via drill 0.3)
  Top 0.15: 43.49,44.74 43.49,50.97 U1.5 | 43.49,44.74 49.58,38.64 D11.2 | v79.36,14.4 81.99,14.4 82.27,14.68 82.27,15.1 J1.14 | v50.41,32.83 49.72,33.52 R7.1 | v17.73,41.55 15.79,43.49 15.79,43.9 U2.7 | v6.92,89.06 6.65,89.33 5.82,89.33 J4.P3 | v12.19,22.16 6.65,16.62 TP7.TP | v39.89,41.13 43.49,44.74
  Bottom 0.15: v79.36,14.4 78.94,14.4 78.39,13.85 76.45,13.85 57.48,32.83 v50.41,32.83 47.92,32.83 39.75,41 | v17.73,41.55 39.2,41.55 39.75,41 | v6.92,89.06 6.92,65.37 16.62,55.68 16.62,42.66 v17.73,41.55 | v12.19,22.16 12.19,26.73 17.45,31.99 17.45,41.27 v17.73,41.55 | 39.75,41 v39.89,41.13
N$1
  Top 0.15: 122.85,39.2 122.85,38.5 C1_BAT1.1 | 122.85,39.2 121.6,40.44 D2.1 | 123.96,40.3 124.51,40.3 IC4.3 | 122.85,39.2 123.96,40.3 | 123.96,40.3 123.96,41.83 124.1,41.97 124.23,41.97 124.51,42.24 IC4.1 124.65,42.38 125.84,42.38 130.41,46.95 136.32,46.95 Q1.2
N$2
  Top 0.15: R2_BAT.2 127.83,47.51 127.83,49.58 MCP73831.5
N$3
  Top 0.15: R1_BAT.2 126.03,49.58 126.59,49.58 127.14,50.14 129.64,50.14 130.05,49.72 130.33,49.72 MCP73831.1
N$4
  Top 0.15: CHG_LED.C 124.65,51.11 124.65,49.58 R1_BAT.1
N$5
  Top 0.15: IC1.5 50.69,101.52 51.38,101.52 52.49,100.41 C_DELAY.1
N$6
  Top 0.15: J1.18 80.33,15.23 80.33,18 81.16,18.84 81.16,19.53 80.75,19.94 79.36,19.94 78.81,20.5 EPD_C6.2
N$7
  Top 0.15: C4.1 92.24,29.92 92.24,28.39 90.44,26.59 D3.2 90.3,26.59 88.78,26.59 86.01,29.36 86.01,29.64 83.38,32.27 83.38,33.66 D4.1
N$8  (via drill 0.3)
  Top 0.15: v79.92,18.42 79.92,15.23 J1.19 | v82.27,22.71 v82.27,21.33 | v80.05,21.33 80.05,20.91 80.33,20.64 EPD_C7.2
  Bottom 0.15: v79.92,18.42 79.92,18.97 v82.27,21.33 | v82.27,22.71 81.44,22.71 v80.05,21.33
N$9  (via drill 0.3)
  Top 0.15: v77.01,12.6 77.14,12.46 85.18,12.46 87.25,14.54 87.25,15.1 J1.4 | v69.67,19.94 69.39,19.94 68.97,20.36 EPD_C1.2
  Bottom 0.15: v69.67,19.94 v77.01,12.6
N$11  (via drill 0.3)
  Top 0.15: v86.84,18.42 86.84,15.23 J1.5 | v85.18,23.82 82.96,23.82 82.55,24.23 81.09,24.23 80.81,24.52 v77.84,24.52 | EPD_C2.2 70.5,20.5 71.81,21.81 74.8,21.81 75.01,22.02 v75.34,22.02
  Bottom 0.15: v86.84,18.42 86.84,20.5 87.53,21.19 87.53,21.47 v85.18,23.82 | v75.34,22.02 v77.84,24.52
N$12
  Top 0.15: D7.1 87.12,63.16 87.12,62.33 86.15,61.35 86.15,58.59 91.69,53.05 97.23,53.05 97.78,52.49 97.78,49.05 97.39,48.66 95.59,48.66 95.56,48.69 94.85,48.69 R_CAPACITOR.1
N$13
  Top 0.15: J1.20 79.22,15.23 79.22,17.45 77.97,18.7 77.97,22.58 78.81,23.41 80.88,23.41 81.72,22.58 81.72,20.91 81.99,20.64 EPD_C8.2
N$14
  Top 0.15: R2-USB.1 154.98,52.22 155.81,52.22 159.55,55.95 163.57,55.95 J2.B5
N$17  (via drill 0.3)
  Top 0.15: v78.25,14.4 78.25,15.1 J1.22 | v77.14,16.48 77.14,17.59 75.62,19.11 75.62,19.39 76.31,20.08 76.31,21.05 v76.59,21.33 | v84.76,19.8 85.45,20.5 EPD_C10.2
  Bottom 0.15: v78.25,14.4 78.25,15.37 v77.14,16.48 | v84.76,19.8 84.76,18.97 81.58,15.79 80.25,15.79 77.69,18.35 75.89,18.35 75.27,18.97 75.27,19.54 76.59,20.86 v76.59,21.33
N$18  (via drill 0.3)
  Top 0.15: v149.72,51.94 147.92,51.94 R2-USB1.2 | v158.17,53.05 163.57,53.05 J2.A5
  Bottom 0.15: v149.72,51.94 157.06,51.94 v158.17,53.05
N$20  (via drill 0.3)
  Top 0.15: v77.97,16.62 77.42,16.07 77.42,15.23 J1.24 | v86.98,21.33 87.95,21.33 88.64,20.64 EPD_C12.2
  Bottom 0.15: v86.98,21.33 85.73,20.08 85.73,18.42 82.55,15.23 80.02,15.23 78.63,16.62 v77.97,16.62
PREVGH  (via drill 0.3)
  Top 0.15: v75.9,21.33 75.9,20.64 75.34,20.08 75.34,18.97 76.59,17.73 76.59,14.96 77.7,13.85 78.39,13.85 78.81,14.27 78.81,15.1 J1.21 | v78.39,23.82 81.85,23.82 83.65,22.02 | 83.65,22.02 83.65,20.64 EPD_C9.2 | 83.65,22.02 87.12,22.02 93.07,27.98 93.07,30.33 92.8,30.61 91.83,30.61 91.27,30.05 90.3,30.05 D5.1
  Bottom 0.15: v78.39,23.82 v75.9,21.33
PREVGL  (via drill 0.3)
  Top 0.15: v78.25,16.07 77.84,15.65 77.84,15.23 J1.23 | v86.28,19.8 86.98,20.5 EPD_C11.2 87.12,20.5 87.67,19.94 89.33,19.94 93.35,23.96 93.35,31.3 89.89,34.76 82.55,34.76 81.58,33.79 79.78,33.79 D4.2
  Bottom 0.15: v86.28,19.8 86.28,18.56 82.68,14.96 79.9,14.96 78.8,16.07 v78.25,16.07
RESE
  Top 0.15: J1.3 87.81,15.1 87.81,14.68 85.18,12.05 66.2,12.05 65.51,12.74 65.23,12.74 R3.2 65.09,12.88 64.4,13.57 64.4,17.31 Q3.2
RESE'
  Top 0.15: 63.29,11.63 63.29,11.49 63.16,11.36 SJ1.2 63.29,11.63 | 63.29,11.63 63.29,13.16 R2.2 | 63.29,11.63 65.09,11.63 R3.1
RESET  (via drill 0.3)
  Top 0.15: RESET_BUTTON.4 22.3,109.55 25.62,109.55 RESET_BUTTON.3 25.76,109.55 v26.87,109.55 | R_RESET.1 20.36,107.61 21.05,107.61 21.33,107.34 27.29,107.34 27.56,107.61 C5.1 27.7,107.61 v33.66,101.66 | v44.18,101.66 47.78,101.66 IC1.1 | U2.3 10.66,44.04 10.66,44.32 13.5,47.15 14.41,47.15 21.33,54.07 v21.33,57.2
  Bottom 0.15: v33.66,101.66 v44.18,101.66 | v21.33,57.2 18.28,60.25 18.28,86.28 v33.66,101.66 | v26.87,109.55 26.87,108.44 v33.66,101.66
RTC_RST
  Top 0.15: U2.16 23.41,61.35 23.41,61.08 24.1,60.39 79.64,60.39 80.05,60.8 84.62,60.8 85.45,59.97 85.45,59.55 U3.4
RX
  Top 0.15: U2.24 13.02,61.35 13.02,54.85 6.96,48.79 6.96,34.31 7.76,33.52 7.76,30.75 2.91,25.9 TP2.TP
SCK  (via drill 0.3)
  Top 0.15: v82.68,16.07 82.68,15.23 J1.13 | v43.49,51.66 43.49,52.22 U1.6 | v45.29,36.98 46.12,36.98 D10.2 | v4.71,91.27 4.99,91.55 5.68,91.55 J4.P5 | v13.43,45.15 14.27,44.32 14.27,44.04 U2.6 14.4,43.9 14.4,42.65 18.82,38.23 20.64,38.23 20.77,38.36 41.69,38.36 46.4,33.66 R6.1 46.46,33.53 v47.91,33.53 | v9.28,13.99 6.79,11.49 TP8.TP
  Bottom 0.15: v82.68,16.07 82.27,16.07 81.72,15.51 80.13,15.51 77.64,18 72.71,18 57.2,33.52 47.92,33.52 | v43.49,51.66 43.49,37.95 44.87,36.56 | 47.92,33.52 44.87,36.56 | 44.87,36.56 v45.29,36.98 | v4.71,91.27 4.71,67.17 13.43,58.45 v13.43,45.15 13.43,28.39 9.28,24.24 v9.28,13.99 | v47.91,33.53 47.92,33.52
SCL  (via drill 0.3)
  Top 0.15: 154.29,14.13 154.84,14.13 155.81,13.16 155.81,12.88 SENSOR2.4 | 154.29,14.13 151.8,14.13 150.83,13.16 150.83,5.54 151.66,4.71 152.77,4.71 153.32,5.26 153.6,5.26 R2-PINH.1 | v140.85,53.32 140.16,53.32 U4.7 | v162.32,31.86 162.32,22.99 164.4,20.91 J3.4 | v18.84,60.39 18.28,60.94 18.28,61.35 U2.20 | v83.38,55.4 84.76,55.4 89.19,50.97 | 89.19,50.97 89.19,50.28 U3.16 89.19,50.97 | 89.19,50.97 v89.89,51.66 | v154.28,21.6 154.29,21.59 154.29,14.13
  Bottom 0.15: v18.84,60.39 78.39,60.39 v83.38,55.4 | v89.89,51.66 91.55,53.32 v140.85,53.32 v162.32,31.86 154.29,23.82 v154.29,21.61 v154.28,21.6
SDA  (via drill 0.3)
  Top 0.15: v152.9,5.96 152.77,5.96 152.21,5.4 R1_PINH.1 | v154.84,11.91 154.84,12.6 154.98,12.74 SENSOR2.3 | v141.13,53.88 140.16,53.88 U4.8 | v161.77,33.24 161.77,22.16 164.12,19.8 164.4,19.8 J3.3 | v20.22,59.83 19.53,60.52 19.53,61.35 U2.19 | v82.68,55.4 86.56,51.52 87.12,51.52 87.39,51.24 | 87.39,51.24 87.95,50.69 87.95,50.28 U3.15 | 87.39,51.24 v87.81,51.66
  Bottom 0.15: v152.9,5.96 152.9,9.97 v154.84,11.91 154.84,23.68 162.88,31.72 162.88,32.13 v161.77,33.24 v141.13,53.88 90.03,53.88 v87.81,51.66 | v20.22,59.83 78.25,59.83 v82.68,55.4
SRC
  Top 0.15: 87.67,30.89 86.84,30.05 D5.2 | 87.67,30.89 87.95,31.16 92.24,31.16 C4.2 | 81.44,30.75 78.53,27.84 78.53,26.59 76.04,24.1 75.62,24.1 74.79,23.27 74.79,22.92 74.38,22.51 68.91,22.51 65.75,19.35 65.45,19.35 65.37,19.43 Q3.3 | 87.67,30.89 84.07,34.49 82.68,34.49 81.44,33.24 81.44,30.75 | 81.44,30.75 L1.1
SS_SD  (via drill 0.3)
  Top 0.15: 14.54,85.18 8.45,91.27 8.45,98.75 R10.1 | U2.4 11.91,44.04 11.91,44.24 16.98,49.31 v17.17,49.31 | 14.54,85.18 v13.86,84.5 | J4.P2 6.27,88.22 8.71,88.22 v8.72,88.22 | D8.2 16.96,97.82 16.96,94.97 17.02,94.91 17.02,90.09 16.9,89.97 16.18,89.97 15.41,89.21 15.41,87.24 16.18,86.48 16.9,86.48 17.02,86.36 17.02,84.39 16.9,84.27 15.45,84.27 14.54,85.18
  Bottom 0.15: v17.17,49.31 17.17,60.11 13.85,63.43 v13.85,84.48 | v13.86,84.5 v13.85,84.48 | v13.85,84.48 10.12,88.22 v8.72,88.22
TX  (via drill 0.3)
  Top 0.15: v11.08,60.11 11.77,60.8 11.77,61.35 U2.25 | v7.2,33.38 5.68,33.38 3.05,30.75 TP1.TP
  Bottom 0.15: v11.08,60.11 8.31,60.11 7.62,60.8 7.34,60.8 6.92,60.39 6.92,46.67 7.62,45.98 7.62,33.79 v7.2,33.38
USB_D+  (via drill 0.3)
  Top 0.15: v148.19,54.43 150.69,51.94 D1.1 | v34.35,54.02 34.35,53.74 24.65,44.04 U2.14
  Bottom 0.15: v148.19,54.43 83.52,54.43 83.1,54.02 v34.35,54.02
USB_D-  (via drill 0.3)
  Top 0.15: v143.76,49.72 148.19,49.72 148.47,50 150.69,50 D1.3 | v32.55,53.46 23.41,44.32 23.41,44.04 U2.13
  Bottom 0.15: v143.76,49.72 76.45,49.72 72.71,53.46 v32.55,53.46
VBAT
  Top 0.15: 133.51,52.08 C2_BAT.1
  Top 0.3: 138.08,53.32 138.08,53.1 138.08,52.9 U4.3 137.77,52.87 137.07,52.87 137,52.8 135.36,51.16 135.36,50.36 | 138.08,53.32 U4.2 | 133.51,52.08 130.88,52.08 130.47,51.66 MCP73831.3 | 135.36,50.36 135.31,50.41 134.96,50.76 133.65,52.08 C2_BAT.1 | 135.36,50.36 136.01,49.72 136.01,48.48 Q1.3 | TP3.TP 148.19,64.13 145.15,64.13 143.76,65.51 142.38,65.51 137.39,60.52 137.39,53.74 137.39,53.65 137.58,53.46 137.8,53.46 137.95,53.46 138.08,53.32
VBUS
  Top 0.15: 121.47,42.52 121.33,42.38 | 126.31,51.24 CHG_LED.A 126.17,51.24 | 127.83,51.52 MCP73831.4 | 121.33,51.11 C1_BAT.1 | 121.6,42.66 D2.2 | 151.94,46.54 C5_USB.1 | 151.94,48.06 C4_USB.1 152.07,48.2 | 152.9,50.97 153.18,50.97
  Top 0.3: 121.33,42.38 119.66,42.38 R1_PWRUSB.2 | 121.47,42.52 D2.2 | 126.31,51.24 127.56,51.24 127.83,51.52 | 122.02,50.41 121.33,51.11 | 126.17,51.24 125.62,51.8 125.59,51.83 124.17,51.83 123.96,51.61 123.96,51.34 123.04,50.41 122.02,50.41 | 121.6,46.81 121.6,50 122.02,50.41 | 121.6,46.81 121.6,42.66 | 151.94,46.54 151.1,45.7 | 151.1,45.7 150.97,45.57 149.66,45.57 149.66,45.58 147.93,45.58 147.91,45.57 143.21,45.57 | Q1.1 135.18,46.26 135.87,46.26 136.33,45.79 136.33,45.7 136.5,45.53 137.53,45.53 137.56,45.57 137.7,45.57 | 151.94,48.06 151.94,46.67 C5_USB.1 | 153.18,50.97 D1.5 | 143.21,45.57 143.21,63.99 TP14.TP | 151.1,45.7 153.18,43.63 PFMF.050.1.2 | 121.6,46.81 127.28,46.81 127.3,46.83 128.43,46.83 128.44,46.81 129.77,46.81 130.19,47.23 130.26,47.3 137.21,47.3 137.69,46.83 137.69,45.58 137.7,45.57 | 137.7,45.57 143.21,45.57 | 152.9,50.97 152.89,50.97 152.07,50.16 152.07,48.2
VRTC
  Top 0.15: 93.63,51.24 R_CAPACITOR.2 | 86.84,50.14 U3.14
  Top 0.3: 93.63,51.24 95.01,51.24 96.4,49.86 C10_SUPERCAP.2 | 86.84,50.14 86.84,48.89 | 86.84,48.89 86.84,47.37 C8.1 | 86.84,48.89 89.61,48.89 91.96,51.24 93.49,51.24 R_CAPACITOR.2
VUSB  (via drill 0.3)
  Top 0.15: 163.71,51.94 163.71,51.8 J2.A4 | 163.71,56.65 J2.B4 | 163.71,56.78 J2.A9 | 163.71,52.08 J2.B9
  Top 0.3: 163.71,51.94 J2.B9 163.31,51.68 162.99,51.68 162.97,51.66 v157.47,51.66 | 163.71,56.78 163.71,56.65 | 163.71,52.08 164.26,52.08 164.32,52.08 164.81,52.57 164.81,56.03 164.34,56.51 163.71,56.51 J2.B4 | v150.83,45.01 150.5,45.01 150.27,45.01 148.89,43.63 PFMF.050.1.1
  Bottom 0.3: v150.83,45.01 v157.47,51.66

## Text on the board
tPlace: GND | GND | INT_RTC | 3V3 | VBUS | VBAT | TX | RX | MISO | MOSI | SCK | EPD_BUSY | EPD_CS | EPD_DC | EPD_RST | EPD_3V3_C | EPD_3V3